# EAGLE design buzzer (EAGLE 9.5.1)
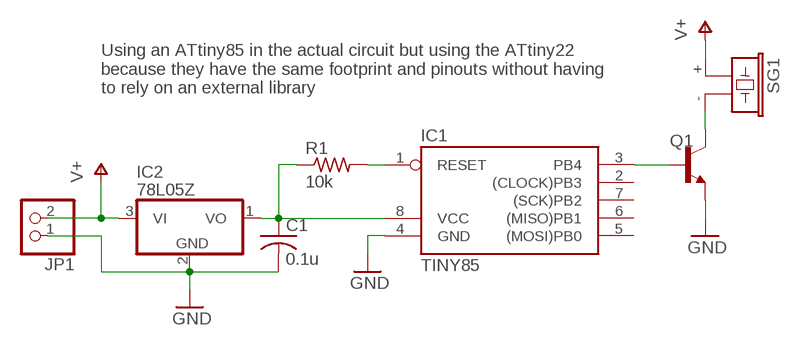
[diagram p0: schematic, sheet 1]

## Parts
C1  0.1u  C-USC0402  [C0402]
IC1  TINY85  TINY22P  [DIL08]
IC2  78L05Z  [TO92]
JP1  PINHD-1X2  [1X02]
Q1  BCX70SMD  [SOT23]
R1  10k  R-US_R0402  [R0402]
SG1  F/CM12P  [F/CM12P]

## Nets
5V: C1.1 IC1.8(VCC) IC2.1(VO) R1.1
BUZ_CTRL: IC1.3(PB4) Q1.1(B)
BUZ_NEG: Q1.3(C) SG1.-
GND: C1.2 IC1.4(GND) IC2.2(GND) JP1.1 Q1.2(E)
RESET: IC1.1(RESET) R1.2
V+: IC2.3(VI) JP1.2 SG1.+
Unconnected: IC1.2((CLOCK)PB3) IC1.5((MOSI)PB0) IC1.6((MISO)PB1) IC1.7((SCK)PB2)

## Notes on the sheet
- Using an ATtiny85 in the actual circuit but using the ATtiny22 
  because they have the same footprint and pinouts without having
  to rely on an external library

## Library data of the parts
C1 = rcl:C-US: CAPACITOR, American symbol; SPICEPREFIX: C
IC1 = atmel:TINY22: MICROCONTROLLER 1K ROM 128 bytes RAM 128 bytes EEPROM; OC_FARNELL: unknown; OC_NEWARK: unknown
IC2 = linear:78*: Positive VOLTAGE REGULATOR Source: http://cache.national.com/ds/LM/LM78L05.pdf http://www.fairchildsemi.com/ds/LM/LM7805.pdf
JP1 = pinhead:PINHD-1X2: PIN HEADER
Q1 = transistor-npn:BCX70*: NPN Transistor
R1 = rcl:R-US_: RESISTOR, American symbol; SPICEPREFIX: R
SG1 = buzzer:F/CM12P: BUZZER Source: Buerklin; OC_FARNELL: unknown; OC_NEWARK: unknown

## Board
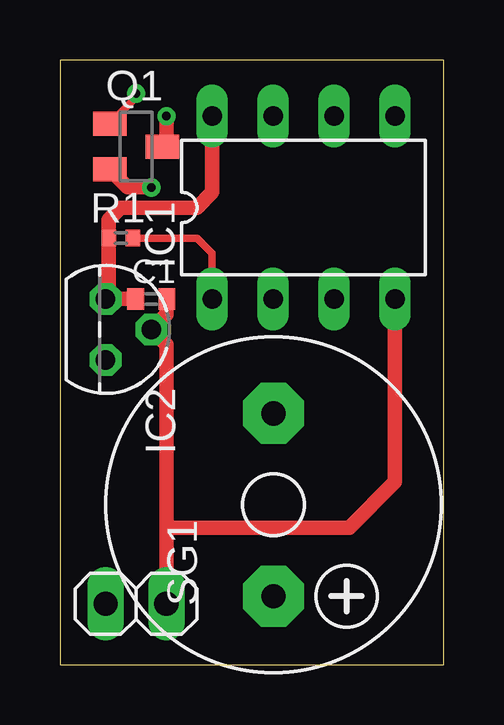
[diagram p1: board, top side]
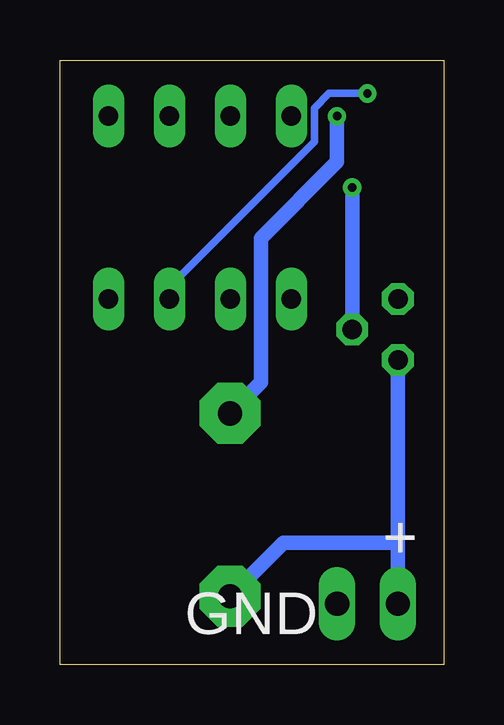
[diagram p2: board, bottom side, seen from below]

Size 16 x 25.2 mm. Coordinates in mm from the lower left corner, seen from the top.
Outline: 0,0 16,0 16,25.2 0,25.2 0,0
Copper layers (1*16): Top 0.035mm / dielectric 1.5mm / Bottom 0.035mm
Design rules "default": minimum track width 6mil, minimum drill 0.35mm, track to track 6mil, track to pad 6mil, pad to pad 6mil, via to via 6mil, smd to smd 6mil, copper to edge 40mil, drill to drill 6mil, minimum pad ring 10mil, minimum via ring 8mil, stop-mask expansion 4mil, vias tented up to drill 0mil, thermal gap 10mil

### Footprints (pad centres in the part's own frame; a part is rotated, then mirrored left to right if it is on the bottom)
C0402 = smd 0.7 x 0.9: 1 -0.65,0; 2 0.65,0
DIL08 = drill 0.813 long: 1 -3.81,-3.81; 2 -1.27,-3.81; 3 1.27,-3.81; 4 3.81,-3.81; 5 3.81,3.81; 6 1.27,3.81; 7 -1.27,3.81; 8 -3.81,3.81
TO92 = drill 0.813 octagon: 1 -1.27,0; 2 0,1.905; 3 1.27,0
1X02 = drill 1.016 long: 1 -1.27,0; 2 1.27,0
SOT23 = smd 1 x 1.4: 1 -0.95,-1.1; 2 0.95,-1.1; 3 0,1.1
R0402 = smd 0.6 x 0.7: 1 -0.5,0; 2 0.5,0
F/CM12P = drill 1.016 pad 2.54 octagon: + 3.81,0; - -3.81,0

### Placement (x,y rotation side)
C1  3.81,15.24 0 top
IC1  10.16,19.05 0 top
IC2  1.91,13.97 270 top
JP1  3.17,2.54 180 top
Q1  3.17,21.59 270 top
R1  2.54,17.78 0 top
SG1  8.9,6.67 270 top

### Tracks (layer width: path | path; a pad name or v marks a point on that pad's centre or on a via)
5V
  Top 0.61: IC1.8 6.35,19.68 5.71,19.05 2.54,19.05 2.04,18.55 R1.1 2.04,15.38 IC2.1 C1.1
BUZ_CTRL  (via drill 0.35)
  Top 0.305: Q1.1 3.17,23.64 v3.17,23.8
  Bottom 0.305: v3.17,23.8 4.77,23.8 5.38,23.19 5.38,21.8 11.43,15.76 IC1.3
BUZ_NEG  (via drill 0.35)
  Top 0.61: v4.45,22.86 4.45,21.76 Q1.3
  Bottom 0.61: SG1.- 7.62,11.76 7.62,17.78 4.45,20.95 v4.45,22.86
GND  (via drill 0.35)
  Top 0.61: Q1.2 2.83,19.89 v3.81,19.89 | 4.45,5.71 4.45,13.34 IC2.2 4.45,14.61 4.45,15.22 C1.2 | 4.45,5.71 JP1.1 | IC1.4 13.97,7.62 12.06,5.71 4.45,5.71
  Bottom 0.61: v3.81,19.89 IC2.2
RESET
  Top 0.305: R1.2 5.71,17.78 6.35,17.14 IC1.1
V+
  Bottom 0.61: IC2.3 1.91,5.08 | 1.91,5.08 JP1.2 | SG1.+ 6.68,5.08 1.91,5.08

### Text on the board
bNames: + | GND